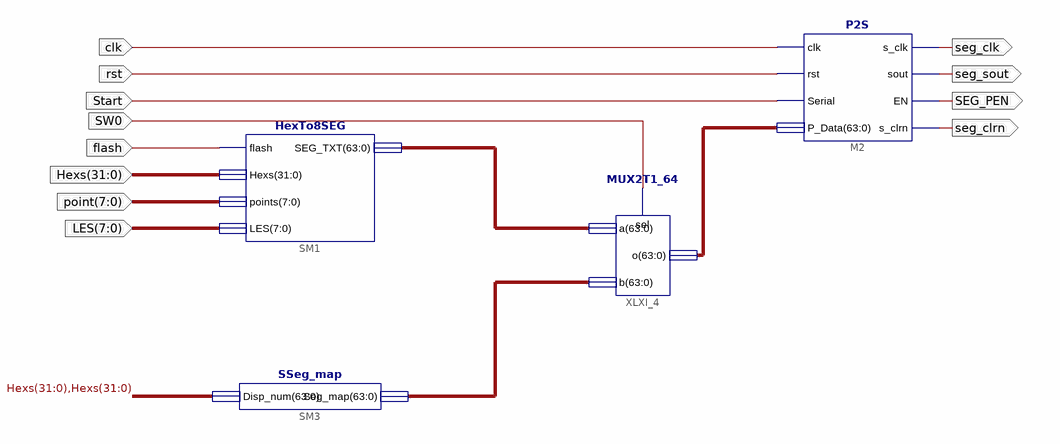
[diagram p0: schematic sheet 1]
// Xilinx ISE schematic SSeg7_Dev.sch (kintex7) as structural Verilog: 4 symbols, 12 ports
module SSeg7_Dev (
  input  [7:0] LES,
  input  [7:0] point,
  input  [31:0] Hexs,
  input  flash,
  input  SW0,
  input  Start,
  input  rst,
  input  clk,
  output seg_clk,
  output seg_sout,
  output SEG_PEN,
  output seg_clrn
);

  wire [63:0] XLXN_3, XLXN_4, XLXN_11;

  P2S M2 (
    .clk(clk), .rst(rst), .Serial(Start), .P_Data(XLXN_11), .s_clk(seg_clk), .EN(SEG_PEN), .sout(seg_sout),
    .s_clrn(seg_clrn));
  HexTo8SEG SM1 (.flash(flash), .Hexs(Hexs), .points(point), .LES(LES), .SEG_TXT(XLXN_3));
  SSeg_map SM3 (.Disp_num({Hexs, Hexs}), .Seg_map(XLXN_4));
  MUX2T1_64 XLXI_4 (.b(XLXN_4), .sel(SW0), .a(XLXN_3), .o(XLXN_11));
endmodule
